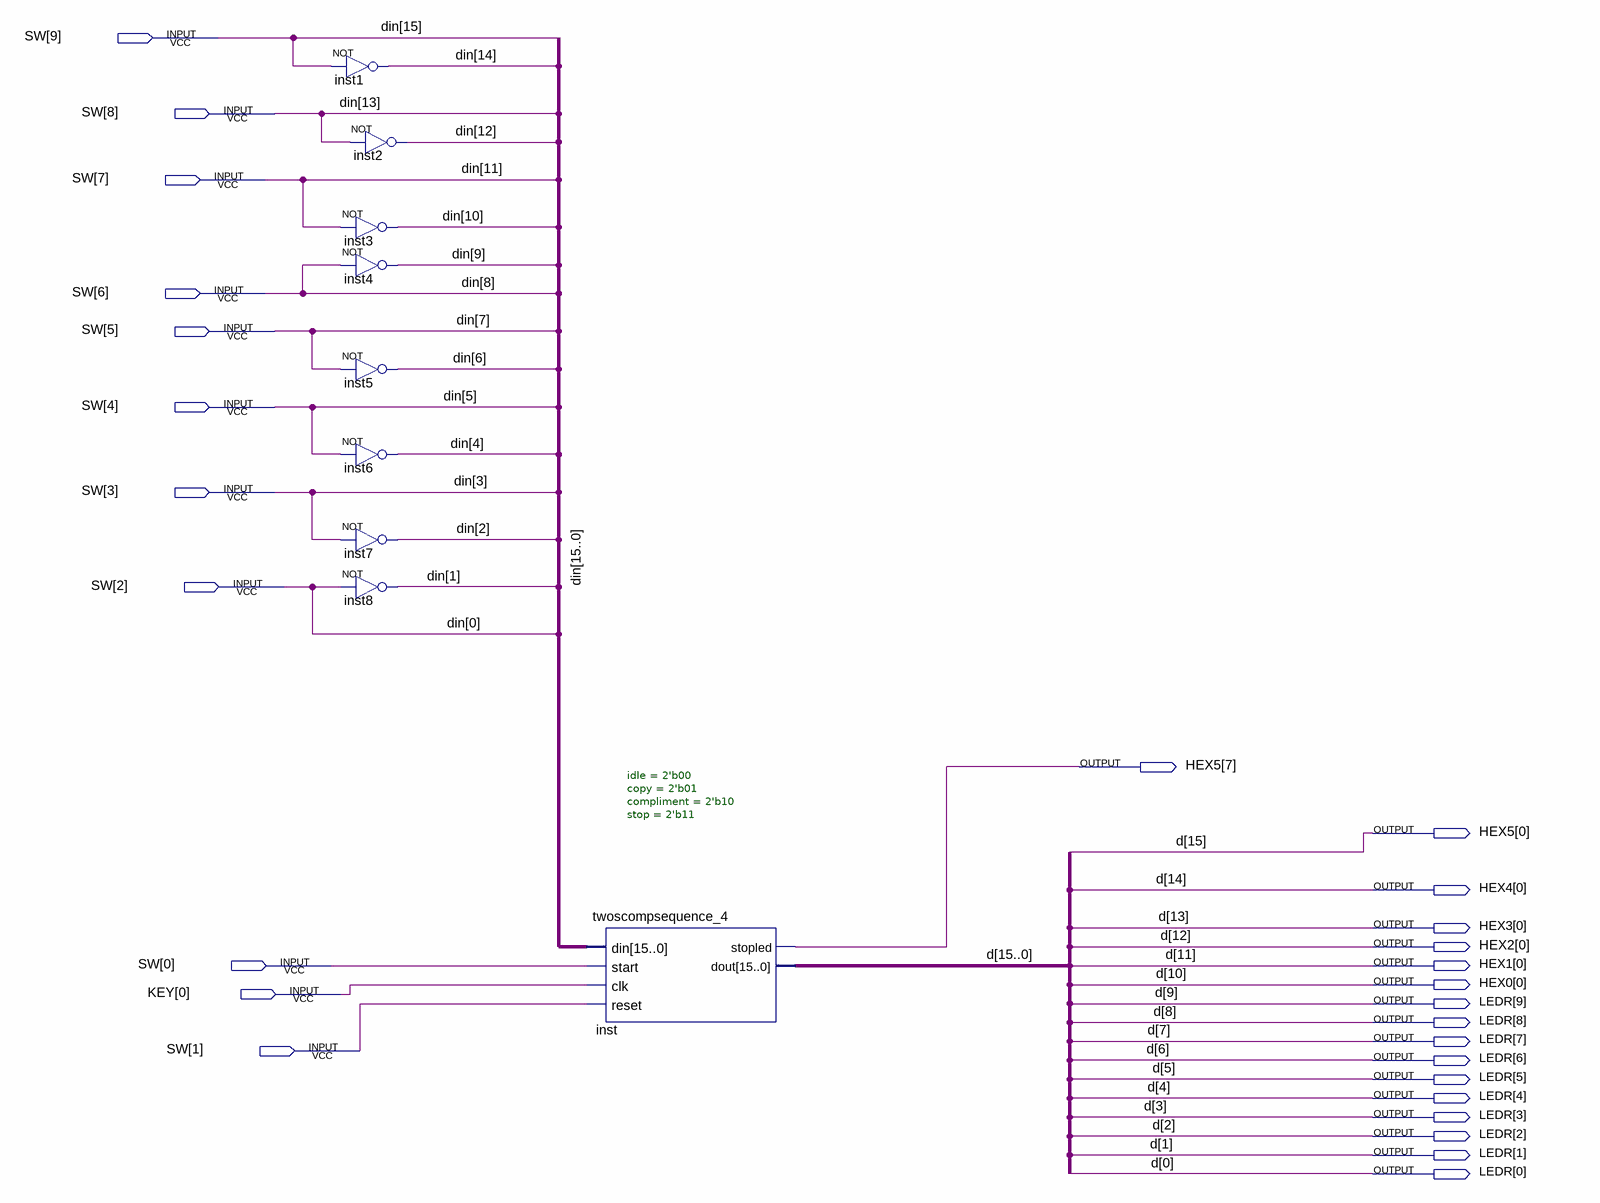
[diagram p0: schematic sheet]
// Quartus schematic twoscomp.bdf as structural Verilog: 9 symbols, 28 pins
module twoscomp (
  input  [9:0] SW,
  input  [0:0] KEY,
  output [7:0] HEX5,
  output [0:0] HEX4,
  output [0:0] HEX3,
  output [0:0] HEX2,
  output [0:0] HEX1,
  output [0:0] HEX0,
  output [9:0] LEDR
);

  wire [14:1] din;

  not inst1 (din[14], SW[9]);
  not inst2 (din[12], SW[8]);
  not inst3 (din[10], SW[7]);
  not inst4 (din[9], SW[6]);
  not inst5 (din[6], SW[5]);
  not inst6 (din[4], SW[4]);
  not inst7 (din[2], SW[3]);
  not inst8 (din[1], SW[2]);
  twoscompsequence_4 #(.idle(2'b00), .copy(2'b01), .compliment(2'b10), .stop(2'b11)) inst (
    .din({SW[9], din[14], SW[8], din[12], SW[7], din[10:9], SW[6:5], din[6], SW[4], din[4], SW[3], din[2:1], SW[2]}),
    .start(SW[0]), .clk(KEY[0]), .reset(SW[1]), .stopled(HEX5[7]),
    .dout({HEX5[0], HEX4[0], HEX3[0], HEX2[0], HEX1[0], HEX0[0], LEDR}));

  // Other names for the same wires on the sheet: d[15:0] = {HEX5[0], HEX4[0], HEX3[0], HEX2[0], HEX1[0], HEX0[0], LEDR};
  //   din (some bits) = SW[9:2]
endmodule
